# Altium schematic sheet RS485.SchDoc
size A4; SheetNumber: 5; SheetTotal: 9
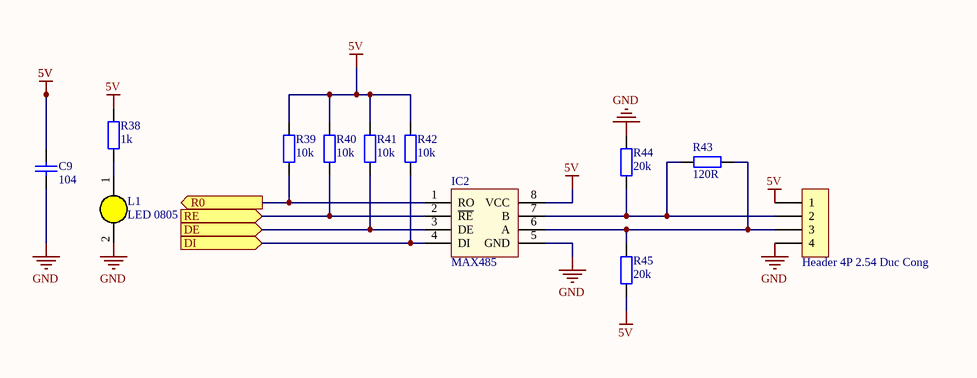
[diagram p0: RS485.SchDoc]

## Parts
C9  104  [tu 0805]
H1  Header 4P 2.54 Duc Cong  [Header 4P DC 2.54]
IC2  MAX485  [DIP8/W0.3]
L1  LED 0805  [LED-0805-Yellow]
R38  1k  [tro smd 0805]
R39  10k  [tro smd 0805]
R40  10k  [tro smd 0805]
R41  10k  [tro smd 0805]
R42  10k  [tro smd 0805]
R43  120R  [tro smd 0805]
R44  20k  [tro smd 0805]
R45  20k  [tro smd 0805]

## Ports
DE (in), DI (in), R0 (out), RE (in)

## Nets
5V: C9.2 H1.1 IC2.8(VCC) R38.2 R39.2 R40.2 R41.2 R42.2 R45.2
GND: C9.1 H1.4 IC2.5(GND) L1.2(K) R44.2
DE: IC2.3(DE) R41.1 ; port DE
DI: IC2.4(DI) R42.1 ; port DI
R0: IC2.1(RO) R39.1 ; port R0
RE: IC2.2(~{RE}) R40.1 ; port RE
NetH1_2: H1.2 IC2.7(B) R43.1 R44.1
NetH1_3: H1.3 IC2.6(A) R43.2 R45.1
NetL1_1: L1.1(A) R38.1

## Library data of the parts
C9 = Tu 0805 104 50V 10%: Dán; Don_Vi: Con; So_Chan: 2; Ten_Linh_Kien: Tụ 0805 104-100nF 10% 50V; Ma_Hang: MH004551; Chung_Loai: Dán; Kieu_Chan: *
H1 = Header 4P 2.54 Duc Cong: Cắm; Ten_Linh_Kien: Header 4P XH2.54-4P Đực Cong; Don_Vi: Con; Ma_Hang: MH001310; Chung_Loai: Cắm
IC2 = MAX485: RS232 - RS485 (Same sn75176)
L1 = LED 0805 Vang: Dán; Don_Vi: Con; Ma_Hang: MH002329; Ten_Linh_Kien: LED 0805 Màu Vàng ( Yellow); Ghi_Chu: *; Kieu_Chan: *; Chung_Loai: Dán
R38 = Tro 0805 1% 1k: Dán; Don_Vi: Con; So_Chan: 2; Ten_Linh_Kien: Trở 0805 1% 1k; Ma_Hang: MH005468; Chung_Loai: Dán; Kieu_Chan: *
R39-R42 = Tro 0805 1% 10k: Dán; Don_Vi: Con; So_Chan: 2; Ten_Linh_Kien: Trở 0805 1% 10k; Ma_Hang: MH005473; Chung_Loai: Dán; Kieu_Chan: *
R43 = Tro 0805 5% 120R: Dán; Don_Vi: Con; So_Chan: 2; Ten_Linh_Kien: Trở 0805 5% 120R; Ma_Hang: MH005253; Chung_Loai: Dán; Kieu_Chan: *
R44 R45 = Tro 0805 5% 20k: Dán; Don_Vi: Con; So_Chan: 2; Ten_Linh_Kien: Trở 0805 5% 20k; Ma_Hang: MH005247; Chung_Loai: Dán; Kieu_Chan: *